# EAGLE schematic evloggerv2 (EAGLE 6.6.0)
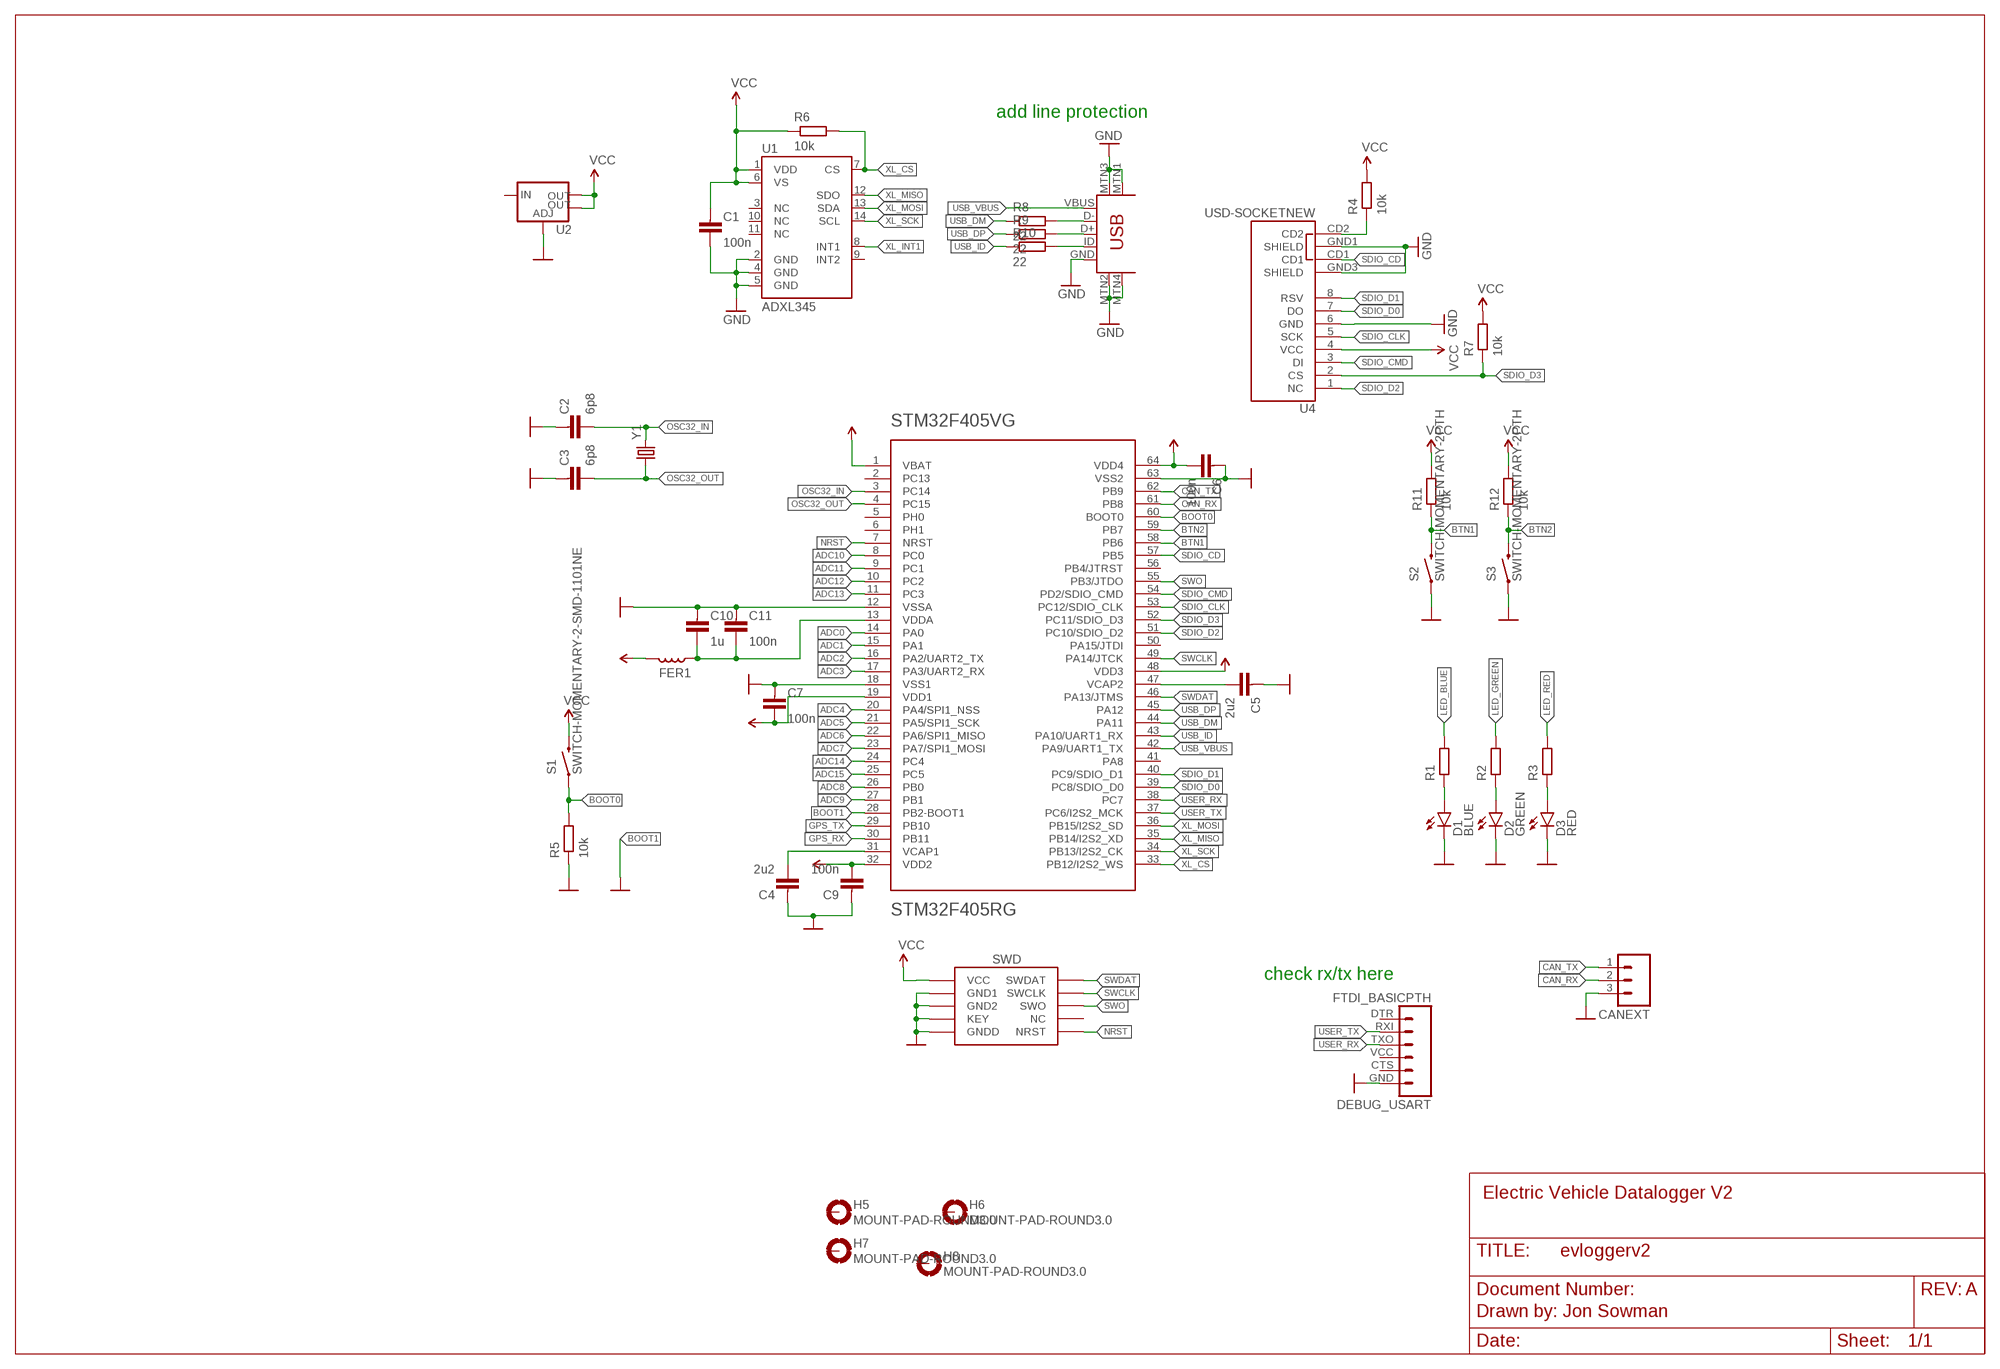
[diagram p0: schematic, sheet 1]

## Parts
C1  100n  CAPACITOR0603-N  [C0603-N]
C2  6p8  CAPACITOR0603-N  [C0603-N]
C3  6p8  CAPACITOR0603-N  [C0603-N]
C4  2u2  CAPACITOR0603-N  [C0603-N]
C5  2u2  CAPACITOR0603-N  [C0603-N]
C6  100n  CAPACITOR0603-N  [C0603-N]
C7  100n  CAPACITOR0603-N  [C0603-N]
C9  100n  CAPACITOR0603-N  [C0603-N]
C10  1u  CAPACITOR0603-N  [C0603-N]
C11  100n  CAPACITOR0603-N  [C0603-N]
CANEXT  M03PTH  [1X03]
D1  BLUE  LED-BLUE0603  [LED-0603]
D2  GREEN  LED-GREEN0603  [LED-0603]
D3  RED  LED-RED0603  [LED-0603]
DEBUG_USART  FTDI_BASICPTH  [FTDI_BASIC]
FER1  INDUCTOR0603-N  [L0603-N]
H5  MOUNT-PAD-ROUND3.0  [3,0-PAD]
H6  MOUNT-PAD-ROUND3.0  [3,0-PAD]
H7  MOUNT-PAD-ROUND3.0  [3,0-PAD]
H8  MOUNT-PAD-ROUND3.0  [3,0-PAD]
R1  RESISTOR0603-N  [R0603-N]
R2  RESISTOR0603-N  [R0603-N]
R3  RESISTOR0603-N  [R0603-N]
R4  10k  RESISTOR0603-N  [R0603-N]
R5  10k  RESISTOR0603-N  [R0603-N]
R6  10k  RESISTOR0603-N  [R0603-N]
R7  10k  RESISTOR0603-N  [R0603-N]
R8  22  RESISTOR0603-N  [R0603-N]
R9  22  RESISTOR0603-N  [R0603-N]
R10  22  RESISTOR0603-N  [R0603-N]
R11  10k  RESISTOR0603-N  [R0603-N]
R12  10k  RESISTOR0603-N  [R0603-N]
S1  SWITCH-MOMENTARY-2-SMD-1101NE  [TACTILE-SWITCH-1101NE]
S2  SWITCH-MOMENTARY-2PTH  [TACTILE-PTH]
S3  SWITCH-MOMENTARY-2PTH  [TACTILE-PTH]
STM32F405VG  STM32F405RG  [TQFP64]
U1  ADXL345  [LGA14]
U2  V_REG_LM1117SOT223  [SOT223]
U4  USD-SOCKETNEW  [MICRO-SD-SOCKET-PP]
U$1  SWD_PTH_SHROUD  [SWD_PTH_SHROUD]
U$2  USB-MINIB-5PIN  [USB-MINIB]
Y1  CRYSTAL32-SMD  [CRYSTAL-32KHZ-SMD]

## Nets
ADC0: STM32F405VG.14(PA0)
ADC1: STM32F405VG.15(PA1)
ADC2: STM32F405VG.16(PA2/UART2_TX)
ADC3: STM32F405VG.17(PA3/UART2_RX)
ADC4: STM32F405VG.20(PA4/SPI1_NSS)
ADC5: STM32F405VG.21(PA5/SPI1_SCK)
ADC6: STM32F405VG.22(PA6/SPI1_MISO)
ADC7: STM32F405VG.23(PA7/SPI1_MOSI)
ADC8: STM32F405VG.26(PB0)
ADC9: STM32F405VG.27(PB1)
ADC10: STM32F405VG.8(PC0)
ADC11: STM32F405VG.9(PC1)
ADC12: STM32F405VG.10(PC2)
ADC13: STM32F405VG.11(PC3)
ADC14: STM32F405VG.24(PC4)
ADC15: STM32F405VG.25(PC5)
BOOT0: R5.2 S1.P$1 STM32F405VG.60(BOOT0)
BOOT1: STM32F405VG.28(PB2-BOOT1) ; supply symbol labelled GND
BTN1: R11.1 S2.3 STM32F405VG.58(PB6)
BTN2: R12.1 S3.3 STM32F405VG.59(PB7)
CAN_RX: CANEXT.2 STM32F405VG.61(PB8)
CAN_TX: CANEXT.1 STM32F405VG.62(PB9)
GND: C1.2 C2.1 C3.1 C4.1 C5.1 C6.1 C7.1 C9.1 C10.1 C11.1 CANEXT.3 D1.C D2.C D3.C DEBUG_USART.GND R5.1 S2.1 S3.1 STM32F405VG.18(VSS1) STM32F405VG.63(VSS2) U1.2(GND) U1.4(GND) U1.5(GND) U2.1(ADJ) U4.6(GND) U4.GND1(SHIELD) U4.GND3(SHIELD) U$1.3(GND1) U$1.5(GND2) U$1.7(KEY) U$1.9(GNDD) U$2.GND U$2.MTN1(MTN2) U$2.MTN2(MTN3) U$2.MTN3(MTN1) U$2.MTN4
GPS_RX: STM32F405VG.30(PB11)
GPS_TX: STM32F405VG.29(PB10)
LED_BLUE: R1.2
LED_GREEN: R2.2
LED_RED: R3.2
N$1: R4.1 U4.CD2
N$2: C4.2 STM32F405VG.31(VCAP1)
N$3: C5.2 STM32F405VG.47(VCAP2)
N$4: C10.2 C11.2 FER1.1 STM32F405VG.13(VDDA)
N$5: D3.A R3.1
N$6: D2.A R2.1
N$7: D1.A R1.1
N$8: R8.2 U$2.D-
N$9: R9.2 U$2.D+
N$10: R10.2 U$2.ID
NRST: STM32F405VG.7(NRST) U$1.10(NRST)
OSC32_IN: C2.2 STM32F405VG.3(PC14) Y1.X2
OSC32_OUT: C3.2 STM32F405VG.4(PC15) Y1.X1
SDIO_CD: STM32F405VG.57(PB5) U4.CD1
SDIO_CLK: STM32F405VG.53(PC12/SDIO_CLK) U4.5(SCK)
SDIO_CMD: STM32F405VG.54(PD2/SDIO_CMD) U4.3(DI)
SDIO_D0: STM32F405VG.39(PC8/SDIO_D0) U4.7(DO)
SDIO_D1: STM32F405VG.40(PC9/SDIO_D1) U4.8(RSV)
SDIO_D2: STM32F405VG.51(PC10/SDIO_D2) U4.1(NC)
SDIO_D3: R7.1 STM32F405VG.52(PC11/SDIO_D3) U4.2(CS)
SWCLK: STM32F405VG.49(PA14/JTCK) U$1.4(SWCLK)
SWDAT: STM32F405VG.46(PA13/JTMS) U$1.2(SWDAT)
SWO: STM32F405VG.55(PB3/JTDO) U$1.6(SWO)
USB_DM: R8.1 STM32F405VG.44(PA11)
USB_DP: R9.1 STM32F405VG.45(PA12)
USB_ID: R10.1 STM32F405VG.43(PA10/UART1_RX)
USB_VBUS: STM32F405VG.42(PA9/UART1_TX) U$2.VBUS
USER_RX: DEBUG_USART.TXO STM32F405VG.38(PC7)
USER_TX: DEBUG_USART.RXI STM32F405VG.37(PC6/I2S2_MCK)
VCC: C1.1 C6.2 C7.2 C9.2 FER1.2 R4.2 R6.1 R7.2 R11.2 R12.2 S1.P$2 STM32F405VG.1(VBAT) STM32F405VG.19(VDD1) STM32F405VG.32(VDD2) STM32F405VG.48(VDD3) STM32F405VG.64(VDD4) U1.1(VDD) U1.6(VS) U2.2(OUT) U2.4(OUT) U4.4(VCC) U$1.1(VCC)
XL_CS: R6.2 STM32F405VG.33(PB12/I2S2_WS) U1.7(CS)
XL_INT1: U1.8(INT1)
XL_MISO: STM32F405VG.35(PB14/I2S2_XD) U1.12(SDO)
XL_MOSI: STM32F405VG.36(PB15/I2S2_SD) U1.13(SDA)
XL_SCK: STM32F405VG.34(PB13/I2S2_CK) U1.14(SCL)
Unconnected: DEBUG_USART.CTS DEBUG_USART.DTR DEBUG_USART.VCC H5.B3,0(MOUNT) H6.B3,0(MOUNT) H7.B3,0(MOUNT) H8.B3,0(MOUNT) STM32F405VG.2(PC13) STM32F405VG.5(PH0) STM32F405VG.6(PH1) STM32F405VG.12(VSSA) STM32F405VG.41(PA8) STM32F405VG.50(PA15/JTDI) STM32F405VG.56(PB4/JTRST) U1.3(NC) U1.9(INT2) U1.10(NC) U1.11(NC) U2.3(IN) U$1.8(NC)

## Notes on the sheet
- add line protection
- check rx/tx here
- Electric Vehicle Datalogger V2
- A
- Drawn by: Jon Sowman

## Library data of the parts
C1-C7 C9-C11 = passives-7351:CAPACITOR
CANEXT = SparkFun-Connectors:M03: Header 3 Standard 3-pin 0.1" header. Use with straight break away headers (SKU : PRT-00116), right angle break away headers (PRT-00553), swiss pins (PRT-00743), machine pins (PRT-00117), and female headers (PRT-00115). Molex polarized connector foot print use with SKU : PRT-08232 with associated crimp pins and housings.
D1 = SparkFun-LED:LED-BLUE: Blue LEDs for production use Various blue LEDs stocked by SparkFun production 0603 - DIO-08575 Rebel - DIO-09553 1206 - DIO-09911; PROD_ID: DIO-08575
D2 = SparkFun-LED:LED-GREEN: Various green LEDs Green LEDs used in SFE Production 0603- DIO-00821 LARGE- DIO-00862 LILYPAD- DIO-09910; PROD_ID: DIO-00821
D3 = SparkFun-LED:LED-RED: Assorted Red LEDs LilyPad 1206- DIO-09912 1206- DIO-00809 0603- DIO-00819 "SMART" means more efficient and expensive; PROD_ID: DIO-00819
DEBUG_USART = SparkFun-Connectors:FTDI_BASIC: FTDI Basic header with labels
FER1 = passives-7351:INDUCTOR
H5-H8 = dtb:MOUNT-PAD-ROUND: MOUNTING PAD, round
R1-R12 = passives-7351:RESISTOR
S1 = Mine:SWITCH-MOMENTARY-2: Various NO switches- pushbuttons, reed, etc
S2 S3 = SparkFun-Electromechanical:SWITCH-MOMENTARY-2: Various NO switches- pushbuttons, reed, etc; PROD_ID: SWCH-08441
STM32F405VG = SparkFun-DigitalIC:STM32F405RG: ARM DSP Chip used on the WAV Trigger board.
U1 = SparkFun-Sensors:ADXL345: 3-axis SPI/I2C 2/4/8/16g accelerometer
U2 = SparkFun-PowerIC:V_REG_LM1117: Voltage Regulator LM1117 Standard adjustable voltage regulator but in SMD form. Spark Fun Electronics SKU : COM-00595; PROD_ID: VREG-08170
U4 = SparkFun-Connectors:USD-SOCKET: microSD Socket Push-push type uSD socket. Schematic element and footprint production proven. Spark Fun Electronics SKU : PRT-00127. tDoc lines correctly indicate media card edge positions when inserting (unlocked, locked, depressed). NOTE: CD1 and CD2 are connected internally; PROD_ID: CONN-07820
U$1 = jonsowman:SWD_PTH_SHROUD
U$2 = SparkFun-Connectors:USB-MINIB: Mini-USB "B" connector with 5th pin broken out. Created new symbol breaking out 5th "ID" pin in mini/micro USB connector spec. See: http://en.wikipedia.org/wiki/Mini_usb#Cables. Uses same footprint as 4-pin symbol. Also added pins to connect to mounting / shield pads if required (probably not generally needed as signals aren't shielded once they leave the connector).; PROD_ID: CONN-08193
Y1 = SparkFun-FreqCtrl:CRYSTAL: Various standard crystals. Proven footprints.; PROD_ID: XTAL-07894